# EAGLE schematic Tester v2 final  (EAGLE 9.4.1)
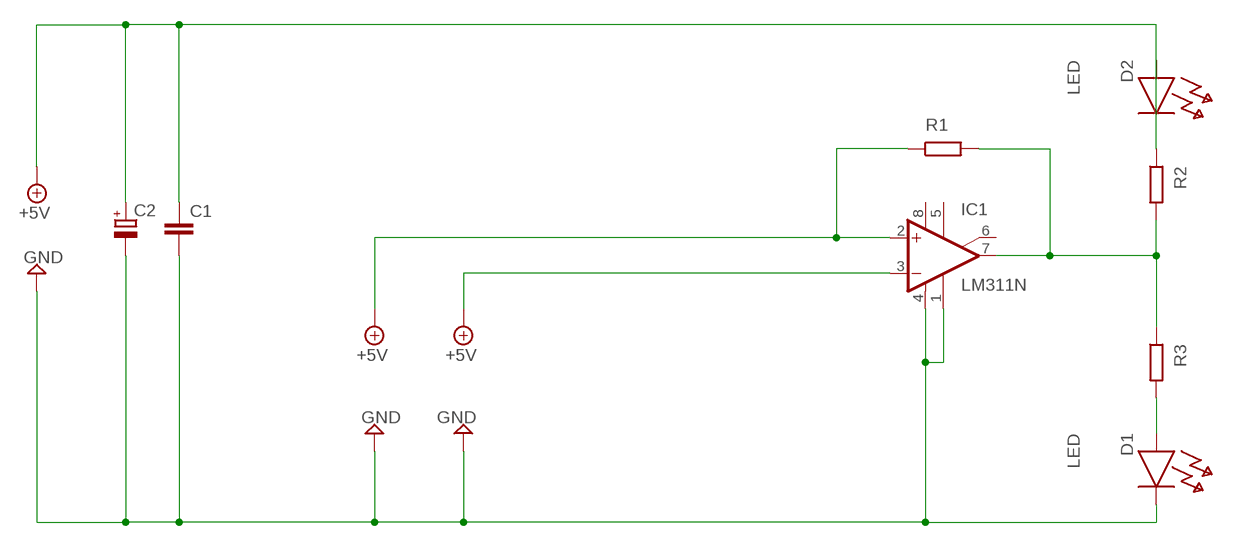
[diagram p0: schematic, sheet 1]

## Parts
C1  C2.5/4  [C2.5-4]
C2  CPOL-EUB45181D  [B45181D]
D1  LED  (no package)
D2  LED  (no package)
IC1  LM311N  [DIL08]
R1  R  (no package)
R2  R  (no package)
R3  R  (no package)

## Nets
+5V: C1.1 C2.+ D2.C IC1.2(+IN) IC1.3(-IN) R1.1
GND: C1.2 C2.- D1.C IC1.1(GND) IC1.4(V-)
N$1: D2.A R2.1
N$2: IC1.7(OUT) R1.2 R2.2 R3.1
N$3: D1.A R3.2
Unconnected: IC1.5(ON) IC1.6(ON/STR)

## Power pins joined to a net without a drawn wire
V+: IC1.8(V+)

## Library data of the parts
C1 = capacitor-wima:C: CAPACITOR naming: grid - package width
C2 = rcl:CPOL-EU: POLARIZED CAPACITOR, European symbol; SPICEPREFIX: C
D1 D2 = ngspice-simulation:LED: Diode
IC1 = linear:LM311: COMPARATOR
R1-R3 = ngspice-simulation:R: RESISTOR